# Altium schematic sheet Sheet9.SchDoc
size A4; SheetNumber: 9; SheetTotal: 9; SPICEModelCacheYVTYLCWH: <root> / <DocumentId>YVTYLCWH</DocumentId> / <CacheFrame Number="0"> / <Model Name="diode" Kind="MDL"> / <Text>.MODEL diode D ()</Text> / </Model> / <Model Name="nmosfet_level1" Kind="MDL"> / <Text>*----------------------------------------------------------------------------------------------------------------------- / *MOSFETs / *--------------------------------------------------------------------------------------------------------------------- / *MOS1 Shichman and Hodges Models / .model NMOSFET_Level1 nmos (Level=1) </Text> / </Model> / </CacheFrame> / </root>
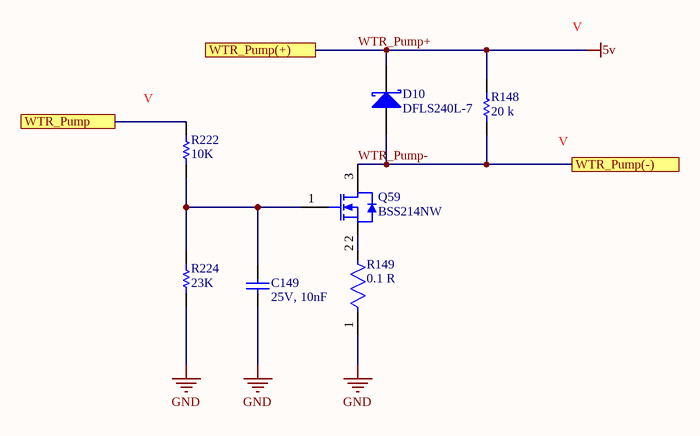
[diagram p0: Sheet9.SchDoc]

## Parts
C149  25V, 10nF  [CAPC2013X94X50LL20T25]
D10  DFLS240L-7  [DIOD-POWERDI123-2_A_V]
Q59  BSS214NW  [INF-PG-SOT-323_N]
R148  value 20 k  (hidden comment: Resistor)
R149  0.1 R  [FP-RL0603-0_55-MFG]
R222  value 10K  (hidden comment: Resistor)
R224  value 23K  (hidden comment: Resistor)

## Ports
WTR_Pump (see Sheet4_1[3A], Sheet5[2B]), WTR_Pump(+) (see Sheet1[3C], Sheet4_1[3A]), WTR_Pump(-) (see Sheet1[3C], Sheet4_1[4A])

## Nets
GND: C149.1 R149.1 R224.1
WTR_Pump+: D10.2(K) R148.2 ; port WTR_Pump(+)  [also labelled 5v]
WTR_Pump: R222.2 ; port WTR_Pump
WTR_Pump-: D10.1(A) Q59.3(DRAIN) R148.1 ; port WTR_Pump(-)
NetC149_2: C149.2 Q59.1(GATE) R222.1 R224.2
NetQ59_2: Q59.2(SOURCE) R149.2

## Library data of the parts
C149 = CMP-2007-04234-1: Manufacturer: AVX Interconnect / Elco; Part Number: 08053C103JAT2A
D10 = CMP-2000-06158-1: Low VF Schottky Barrier Rectifier, 2 A, 40 V, -55 to 125 degC, 2-Pin SMD, RoHS, Tape and Reel; Manufacturer: Diodes Inc; Reverse Voltage-Max [Vrrm]: 40V; Forward Voltage: 0.5V; Average Rectified Current-Max: 2A; Peak Current-Max: 50A; Reverse Current-Max: 100µA; Mounting Technology: SurfaceMount; Package Description: 2-Pin Small Outline Diode, Body 2.8 x 1.78 mm; Manufacturer URL: http://www.diodes.com/; Datasheet URL: http://www.diodes.com/_files/datasheets/ds30516.pdf; Package Reference: POWERDI123-2_A; Datasheet Version: Rev. 8-2, 11/2009
Q59 = CMP-1149-00041-1: N-Channel OptiMOS 2 Small-Signal-Transistor, 20 V VDS, 1.5 A ID, -55 to 150 degC, PG-SOT-323, Reel, Green; Manufacturer: Infineon; VDS (max): 20 V; VGS(th) (max): 1.2Â V; RthJA (max): 250 K/W; QG: 0.8Â nC; RDS (on) (max) (@4.5V): 140 mOhm; VGS(th) (min): 0.7Â V; IDpuls (max): 6 A; ID (max): 1.5Â A; Ptot (max): 0.5Â W; RDS (on) (max): 250 mOhm; Green: TRUE; PackageDescription: 3-Pin Small Outline Transistor Package, 2 x 1.25 mm Body, 0.65 mm Pitch; ComponentLink3URL: http://www.infineon.com/dgdl/SOT323-Package_Overview.pdf?folderId=db3a30431936bc4b0119533e1dcb3c92&fileId=db3a30431936bc4b011953495f283cb1; DatasheetVersion: Rev. 2.2; Mounting Technology: Surface Mount; ComponentLink2URL: http://www.infineon.com/dgdl/BSS214NW_Rev2.2.pdf?folderId=db3a3043156fd573011622e10b5c1f67&fileId=db3a30431b3e89eb011b695aebc01bde; PackageVersion: Apr-08; Halogen-free: TRUE; Packing: Reel; ComponentLink3Description: Package Specification; PartNumber: BSS214NW; ComponentLink2Description: Datasheet; PackageReference: PG-SOT-323; ComponentLink1URL: http://www.infineon.com/; RDS (on) (max) (@2.5V): 250 mOhm; ComponentLink1Description: Manufacturer URL
R148 R222 R224 = Resistor: TC1: 0; SimulationGenericComponent: True; TC2: 0
R149 = CMP-03412-037808-1: RES 0.1 OHM 1% 1/10W 0603; Voltage Rating: 50V; Temperature Coefficient: 800ppm/°C; Max Power Dissipation: 100mW; Resistance: 100mR; Value: 100mR; Case Code (Metric): 1608; Min Operating Temperature: -55°C; Radiation Hardening: No; Case/Package: 0603; Termination: SMD/SMT; Length: 1.6mm; Lead Free: Lead Free; Size Code: 0603; Construction: Rectangular; RoHS Compliant: Yes; Package Quantity: 1; Tolerance: 1%; Military Standard: Not; Height: 0.022inch; Contact Plating: Tin; Resistance Tolerance: 1%; Resistor Type: Thick Film; Technology: THICK FILM; Lead Pitch: 0.25mm; Series: RL; Number of Pins: 2; Width: 0.8mm; Packaging: Tape and Reel; Weight: 7.1E-05oz; Max Operating Temperature: 125°C; Features: Moisture Resistant; Number of Terminations: 2; Voltage Rating (DC): 50V; Case Code (Imperial): 0603; Depth: 0.8mm; Power Rating: 100mW